# EAGLE schematic ESP8266_Dimmer (EAGLE 6.5.0)
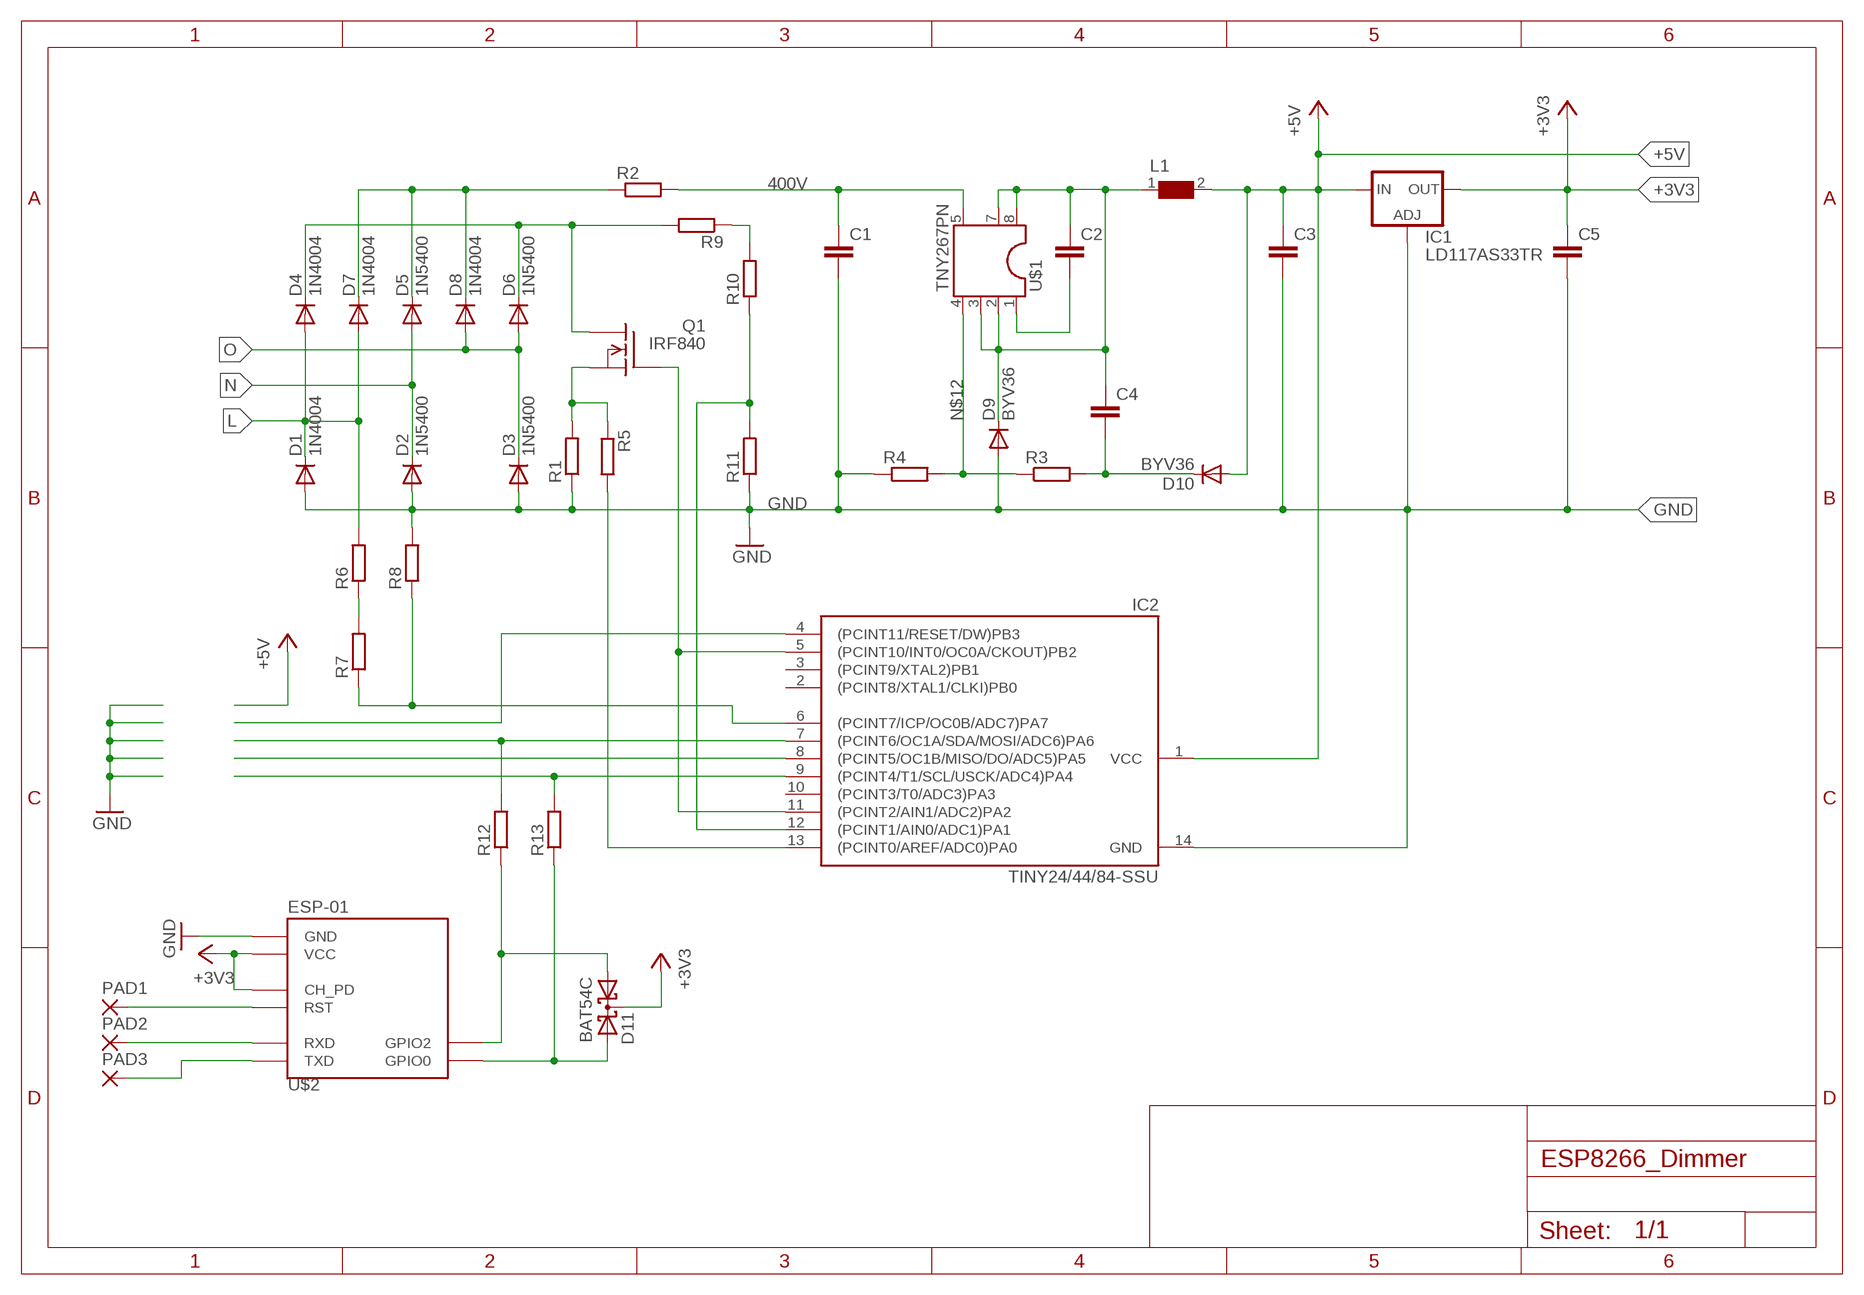
[diagram p0: schematic, sheet 1]

## Parts
C1  C-EUC1812  [C1812]
C2  C-EUC0805  [C0805]
C3  C-EUC0805  [C0805]
C4  C-EUC0805  [C0805]
C5  C-EUC0805  [C0805]
D1  1N4004  [DO41-10]
D2  1N5400  [DO201-15]
D3  1N5400  [DO201-15]
D4  1N4004  [DO41-10]
D5  1N5400  [DO201-15]
D6  1N5400  [DO201-15]
D7  1N4004  [DO41-10]
D8  1N4004  [DO41-10]
D9  BYV36  [SOD57-10]
D10  BYV36  [SOD57-10]
D11  BAT54C  [SOT23]
IC1  LD117AS33TR  [SOT223]
IC2  TINY24/44/84-SSU  [SOIC14]
L1  WE-FPI  [WE-FPI_744010...]
PAD1  1,6/0,8  [1,6/0,8]
PAD2  1,6/0,8  [1,6/0,8]
PAD3  1,6/0,8  [1,6/0,8]
Q1  IRF840  [TO220]
R1  R-EU_M1206  [M1206]
R2  R-EU_0204/5  [0204/5]
R3  R-EU_R0805  [R0805]
R4  R-EU_R0805  [R0805]
R5  R-EU_M1206  [M1206]
R6  R-EU_0204/7  [0204/7]
R7  R-EU_0204/7  [0204/7]
R8  R-EU_0204/7  [0204/7]
R9  R-EU_0204/7  [0204/7]
R10  R-EU_0204/7  [0204/7]
R11  R-EU_0204/7  [0204/7]
R12  R-EU_0204/7  [0204/7]
R13  R-EU_0204/7  [0204/7]
U$1  TNY267PN  [DIP-8B]
U$2  ESP-01  [ESP-01]

## Nets
400V: C1.1 R2.2 U$1.5(D)
+3V3: C5.1 D11.3(CC) IC1.4(OUT) U$2.CH_PD U$2.VCC
+5V: C3.1 D10.A IC1.3(IN) IC2.1(VCC) L1.2
GND: C1.2 C3.2 C5.2 D1.A D2.A D3.A D9.A IC1.1(ADJ) IC2.14(GND) R1.1 R4.1 R8.2 R11.1 U$2.GND
L: D1.C D4.A D7.A R6.2
N: D2.C D5.A
N$1: IC2.13((PCINT0/AREF/ADC0)PA0) R5.2
N$2: D4.C D6.C Q1.2(D) R9.2
N$3: D5.C D7.C D8.C R2.1
N$4: PAD1.1(P) U$2.RST
N$5: C2.1 C4.1 D9.C L1.1 U$1.2(2GND) U$1.3(3GND) U$1.7(7HV-GND) U$1.8(8HV-GND)
N$6: Q1.3(S) R1.2 R5.1
N$7: C2.2 U$1.1(BP)
N$8: R6.1 R7.2
N$9: IC2.6((PCINT7/ICP/OC0B/ADC7)PA7) R7.1 R8.1
N$10: IC2.5((PCINT10/INT0/OC0A/CKOUT)PB2) IC2.11((PCINT2/AIN1/ADC2)PA2) Q1.1(G)
N$11: C4.2 D10.C R3.2
N$12: R3.1 R4.2 U$1.4(EN/UV)
N$13: R9.1 R10.2
N$14: IC2.12((PCINT1/AIN0/ADC1)PA1) R10.1 R11.2
N$15: IC2.9((PCINT4/T1/SCL/USCK/ADC4)PA4) R13.2
N$16: IC2.7((PCINT6/OC1A/SDA/MOSI/ADC6)PA6) R12.2
N$17: PAD2.1(P) U$2.RX(RXD)
N$18: D11.1(A1) R12.1 U$2.GPIO2
N$19: D11.2(A2) R13.1 U$2.GPIO0
N$20: IC2.8((PCINT5/OC1B/MISO/DO/ADC5)PA5)
N$21: IC2.4((PCINT11/RESET/DW)PB3)
N$22: PAD3.1(P) U$2.TX(TXD)
O: D3.C D6.A D8.A
Unconnected: IC2.2((PCINT8/XTAL1/CLKI)PB0) IC2.3((PCINT9/XTAL2)PB1) IC2.10((PCINT3/T0/ADC3)PA3)

## Library data of the parts
C1-C5 = rcl:C-EU: CAPACITOR, European symbol
D1 D4 D7 D8 = diode:1N4004: DIODE general purpose rectifier, 1 A
D2 D3 D5 D6 = diode:1N5400: DIODE standard rectifier, 3 A, 50 V (Motorola)
D9 D10 = diode:BYV36: DIODE fast soft-recovery controlled avalanche rectifier
D11 = diode:BAT54C: Schottky Diodes Source: Fairchild .. BAT54.pdf
IC1 = v-reg:LD117A?*: Low drop fixed and adjustable positive voltage regulators 1 A Source: http://www.st.com/stonline/products/literature/ds/7194/ld1117axx.pdf
IC2 = avr-6:TINY24/44/84
L1 = wuerth_elektronik_EAGLE:WE-FPI: Flat Power Inductor WE-FPI - Extremely flat power inductor <= 1,1 mm - High current capability -- Portable power like PDA, digital camera, PCMICA-cards and displays -- DC/DC-converter -- Recommended for switching regulator IC's from Linear Technology, National Semiconductor, Texas Instruments and Fairchild Semiconductor
PAD1-PAD3 = wirepad:1,6/0,8: THROUGH-HOLE PAD
Q1 = transistor-fet:IRF840: N-Channel Enhancement MOSFET (HEXFET); 500V; 8A; 0,85Ohm
R1-R13 = rcl:R-EU_: RESISTOR, European symbol
U$1 = tny26x_27x:TNY267PN
U$2 = esp8266modules:ESP-01: ESP8266 Wifi Module ESP-01; DIMENSIONS: 14.3 x 24.8 mm; PINS: 8; PITCH: 0.1" / 2.54 mm